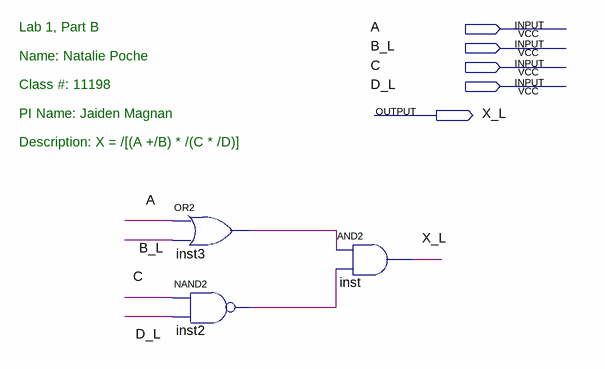
[diagram p0: schematic sheet]
// Quartus schematic Lab1b.bdf as structural Verilog: 3 symbols, 5 pins
module Lab1b (
  input  A,
  input  B_L,
  input  C,
  input  D_L,
  output X_L
);

  wire inst2_out, inst3_out;

  or inst3 (inst3_out, A, B_L);
  nand inst2 (inst2_out, C, D_L);
  and inst (X_L, inst3_out, inst2_out);

  // Notes on the sheet:
  //   Lab 1, Part B
  //   Name: Natalie Poche
  //   Class #: 11198
  //   PI Name: Jaiden Magnan
  //   Description: X = /[(A +/B) * /(C * /D)]
endmodule
